# EAGLE design 04B-350 (EAGLE 9.6.2)
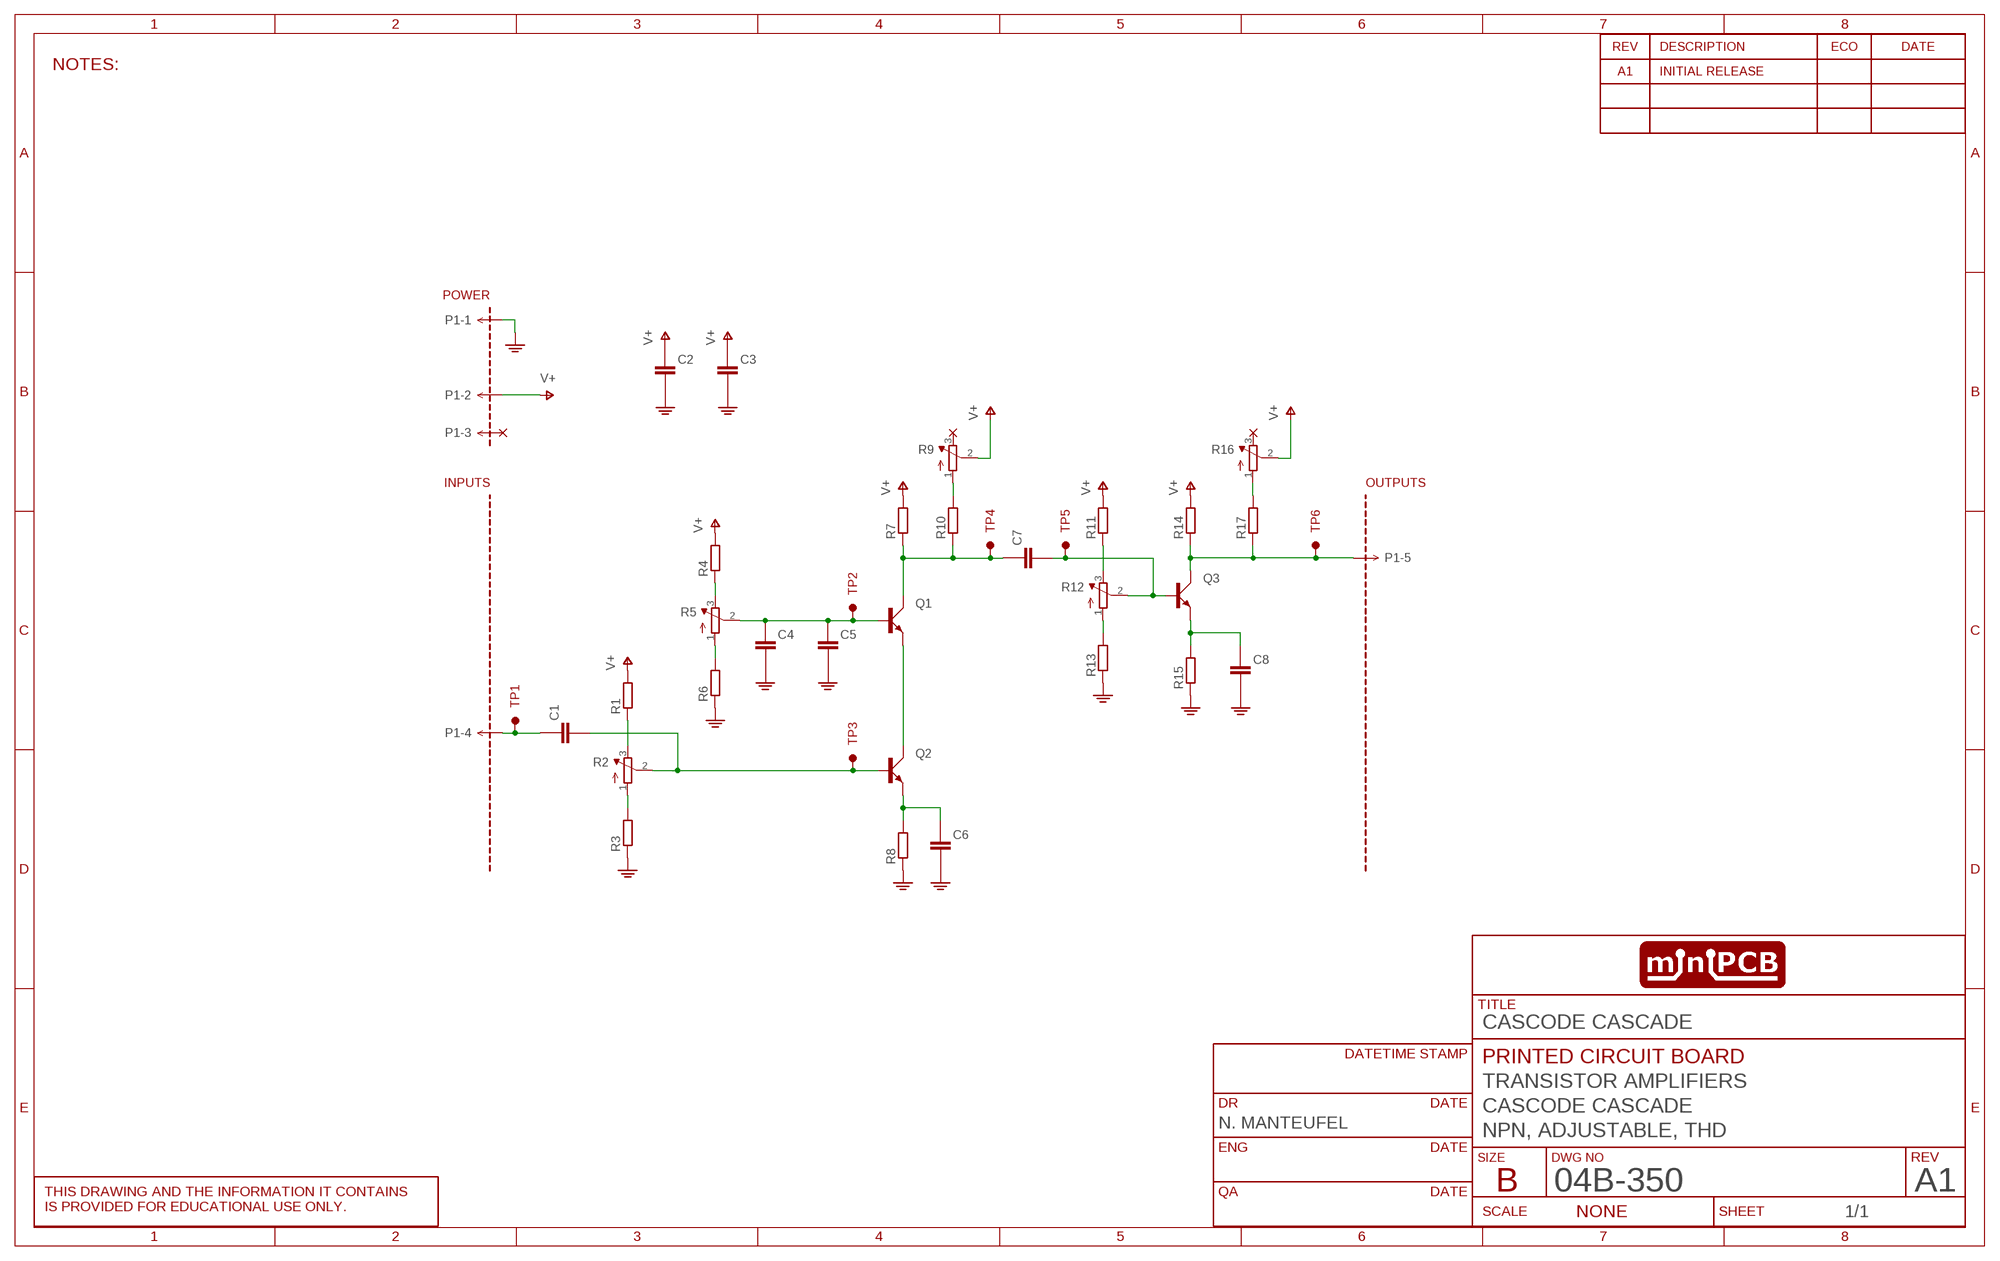
[diagram p0: schematic, sheet 1]
SHEET1 (SCHEMATIC): CIRCUIT_CATEGORY: TRANSISTOR AMPLIFIERS; CIRCUIT_NAME: CASCODE CASCADE; CIRCUIT_VARIANT: NPN, ADJUSTABLE, THD; DR: N. MANTEUFEL; PCB_PCBA: PRINTED CIRCUIT BOARD; REVA: A1; REVISION: A1; TITLE: CASCODE CASCADE

## Parts
C1  CAPACITORTHD  [C050-024X044]
C2  CAPACITORTHD  [C050-024X044]
C3  CAPACITOR_10  [C5MM]
C4  CAPACITOR_10  [C5MM]
C5  CAPACITORTHD  [C050-024X044]
C6  CAPACITOR_10  [C5MM]
C7  CAPACITORTHD  [C050-024X044]
C8  CAPACITOR_10  [C5MM]
P1  MINIPCB_5P5P  [PINS_1X5]
PCB1  MINIPCB_0P50X75  [MINIPCB_0P_50X75]
Q1  BJT_NPNEBC  [TO92-EBC-OVAL]
Q2  BJT_NPNEBC  [TO92-EBC-OVAL]
Q3  BJT_NPNEBC  [TO92-EBC-OVAL]
R1  RESISTORTHD  [0204/10]
R2  TRIMPOT0.100THD  [TRIM_0100]
R3  RESISTORTHD  [0204/10]
R4  RESISTORTHD  [0204/10]
R5  TRIMPOT0.100THD  [TRIM_0100]
R6  RESISTORTHD  [0204/10]
R7  RESISTORTHD  [0204/10]
R8  RESISTORTHD  [0204/10]
R9  TRIMPOT0.100THD  [TRIM_0100]
R10  RESISTORTHD  [0204/10]
R11  RESISTORTHD  [0204/10]
R12  TRIMPOT0.100THD  [TRIM_0100]
R13  RESISTORTHD  [0204/10]
R14  RESISTORTHD  [0204/10]
R15  RESISTORTHD  [0204/10]
R16  TRIMPOT0.100THD  [TRIM_0100]
R17  RESISTORTHD  [0204/10]
TP1  TESTPOINTKE5000-SMTEXT  [PINS_1_TESTPOINT_KE5000_NOTEXT]
TP2  TESTPOINTKE5000-SMTEXT  [PINS_1_TESTPOINT_KE5000_NOTEXT]
TP3  TESTPOINTKE5000-SMTEXT  [PINS_1_TESTPOINT_KE5000_NOTEXT]
TP4  TESTPOINTKE5000-SMTEXT  [PINS_1_TESTPOINT_KE5000_NOTEXT]
TP5  TESTPOINTKE5000-SMTEXT  [PINS_1_TESTPOINT_KE5000_NOTEXT]
TP6  TESTPOINTKE5000-SMTEXT  [PINS_1_TESTPOINT_KE5000_NOTEXT]

## Nets
GND: C2.2(-) C3.- C4.- C5.2(-) C6.- C8.- P1.1 R3.1 R6.1 R8.1 R13.1 R15.1
N$1: C4.+ C5.1(+) Q1.B R5.2(S) TP2.1
N$2: R4.1 R5.3(E)
N$3: R5.1(A) R6.2
N$4: Q1.E Q2.C
N$5: C1.2(-) Q2.B R2.2(S) TP3.1
N$6: R1.1 R2.3(E)
N$7: R2.1(A) R3.2
N$8: R12.1(A) R13.2
N$9: C8.+ Q3.E R15.2
N$10: P1.5 Q3.C R14.1 R17.1 TP6.1
N$11: R11.1 R12.3(E)
N$12: C6.+ Q2.E R8.2
N$13: C7.2(-) Q3.B R12.2(S) TP5.1
N$14: C1.1(+) P1.4 TP1.1
N$15: C7.1(+) Q1.C R7.1 R10.1 TP4.1
N$16: R9.1(A) R10.2
N$17: R16.1(A) R17.2
V+: C2.1(+) C3.+ P1.2 R1.2 R4.2 R7.2 R9.2(S) R11.2 R14.2 R16.2(S)
Unconnected: P1.3 R9.3(E) R16.3(E)

## Notes on the sheet
- NOTES:

## Library data of the parts
C1-C8 = minipcb:CAPACITOR
P1 = minipcb:MINIPCB_5P
PCB1 = minipcb:MINIPCB_0P; CIRCUIT_CATEGORY: TRANSISTOR AMPLIFIERS; PART_NUMBER: 04B-350; REVISION: A1-01; TITLE: CASCODE CASCADE AMPLIFIER
Q1-Q3 = minipcb:BJT_NPN: TRANSISTOR
R1 R3 R4 R6-R8 R10 R11 R13-R15 R17 = minipcb:RESISTOR
R2 R5 R9 R12 R16 = minipcb:TRIMPOT: SMT trimmer potentiometer part number TC33X http://www.ladyada.net/library/eagle
TP1-TP6 = minipcb:TESTPOINT

## Board
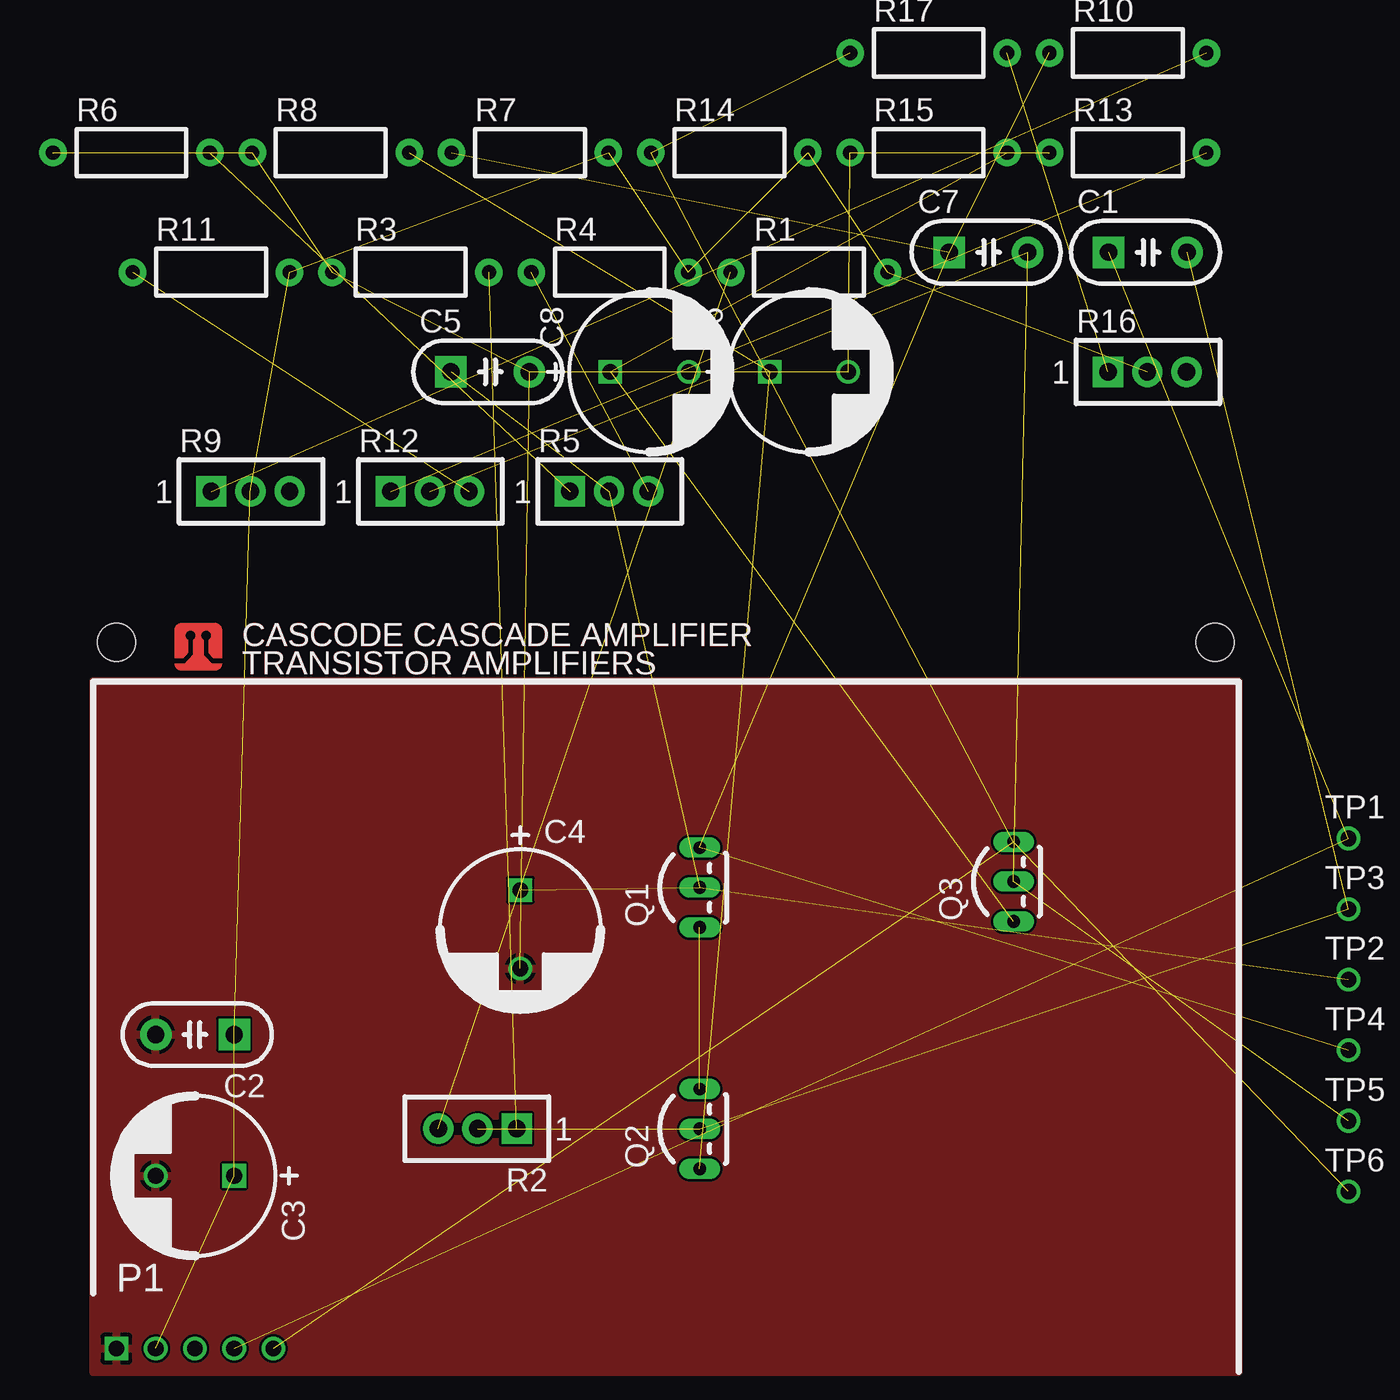
[diagram p1: board, top side]
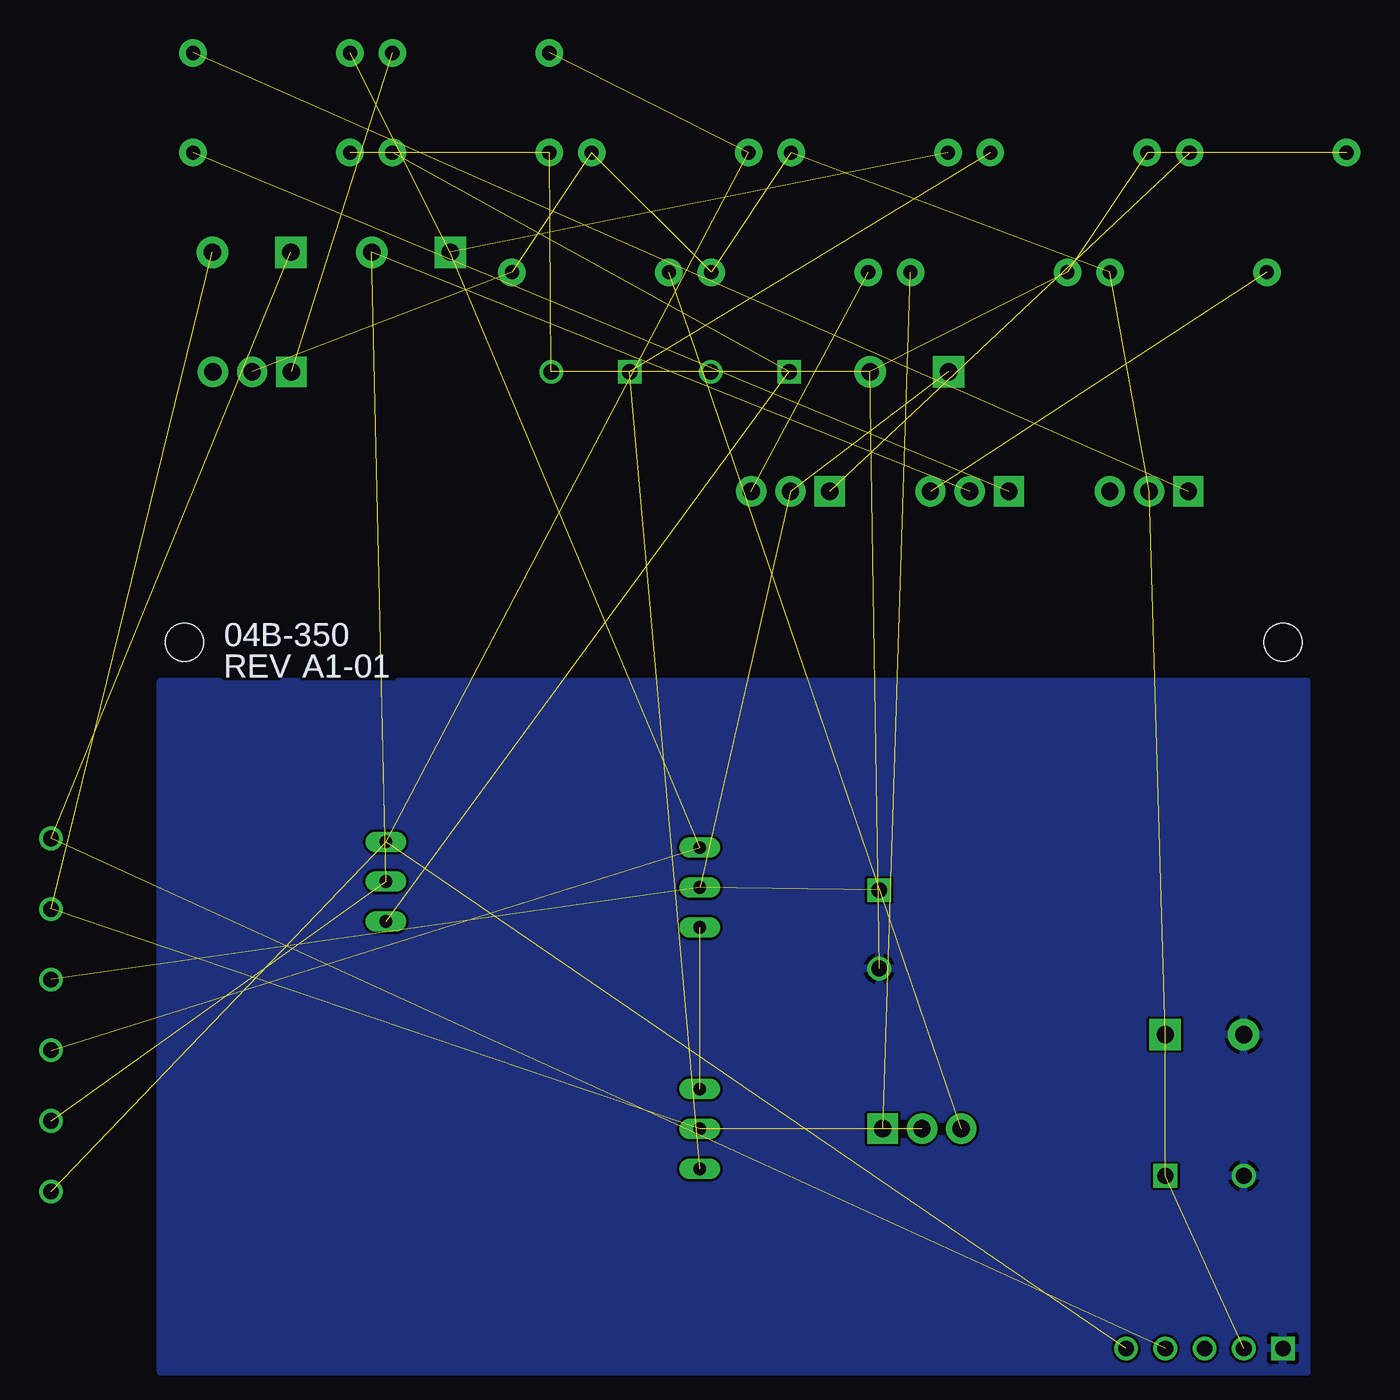
[diagram p2: board, bottom side, seen from below]

No outline drawn. Coordinates in mm, seen from the top.
Copper layers (1*16): Top 0.035mm / dielectric 1.5mm / Bottom 0.035mm
Design rules "default": minimum track width 6mil, minimum drill 0.35mm, track to track 6mil, track to pad 6mil, pad to pad 6mil, via to via 6mil, smd to smd 6mil, copper to edge 40mil, drill to drill 6mil, minimum pad ring 10mil, minimum via ring 8mil, stop-mask expansion 4mil, vias tented up to drill 0mil, thermal gap 10mil

### Footprints (pad centres in the part's own frame; a part is rotated, then mirrored left to right if it is on the bottom)
C050-024X044 = drill 1.1 pad 2 square: 1 -2.5,0 | drill 1.1 pad 2: 2 2.5,0
C5MM = drill 1 square: + -2.5,0 | drill 1: - 2.5,0
PINS_1X5 = drill 1 square: 1 0,0 | drill 1: 2 2.5,0; 3 5,0; 4 7.5,0; 5 10,0
MINIPCB_0P_50X75 = hole 2.4: 72.5,47.5; 2.5,47.5
TO92-EBC-OVAL = drill 0.813 long: B 0,-1.27; C 2.54,-1.27; E -2.54,-1.27
0204/10 = drill 0.9 pad 1.75: 1 -5,0; 2 5,0
TRIM_0100 = drill 1.1 pad 1.93 square: 1 0,0 | drill 1.1 pad 1.93: 2 2.5,0; 3 5,0
PINS_1_TESTPOINT_KE5000_NOTEXT = drill 1: 1 0,0

### Placement (x,y rotation side)
C1  68.22,72.35 0 top
C2  7.5,22.5 180 top
C3  7.5,13.5 180 top
C4  28.23,29.21 270 top
C5  26.31,64.73 0 top
C6  46.63,64.73 0 top
C7  58.06,72.35 0 top
C8  36.47,64.73 0 top
P1  2.5,2.5 0 top
PCB1  0,0 0 top
Q1  38.39,31.87 90 top
Q2  38.39,16.49 90 top
Q3  58.39,32.25 90 top
R1  46.63,71.08 0 top
R2  28,16.5 180 top
R3  21.23,71.08 0 top
R4  33.93,71.08 0 top
R5  31.39,57.11 0 top
R6  3.45,78.7 0 top
R7  28.85,78.7 0 top
R8  16.15,78.7 0 top
R9  8.53,57.11 0 top
R10  66.95,85.05 0 top
R11  8.53,71.08 0 top
R12  19.96,57.11 0 top
R13  66.95,78.7 0 top
R14  41.55,78.7 0 top
R15  54.25,78.7 0 top
R16  65.68,64.73 0 top
R17  54.25,85.05 0 top
TP1  81,35 0 top
TP2  81,26 0 top
TP3  81,30.5 0 top
TP4  81,21.5 0 top
TP5  81,17 0 top
TP6  81,12.5 0 top

### Tracks (layer width: path | path; a pad name or v marks a point on that pad's centre or on a via)
GND  (8 unrouted)
  pour Top: 1,1 74,1 74,45 1,45
  pour Bottom: 1,1 74,1 74,45 1,45
N$1  (4 unrouted)
N$2  (1 unrouted)
N$3  (1 unrouted)
N$4  (1 unrouted)
N$5  (3 unrouted)
N$6  (1 unrouted)
N$7  (1 unrouted)
N$8  (1 unrouted)
N$9  (2 unrouted)
N$10  (4 unrouted)
N$11  (1 unrouted)
N$12  (2 unrouted)
N$13  (3 unrouted)
N$14  (2 unrouted)
N$15  (4 unrouted)
N$16  (1 unrouted)
N$17  (1 unrouted)
V+  (9 unrouted)